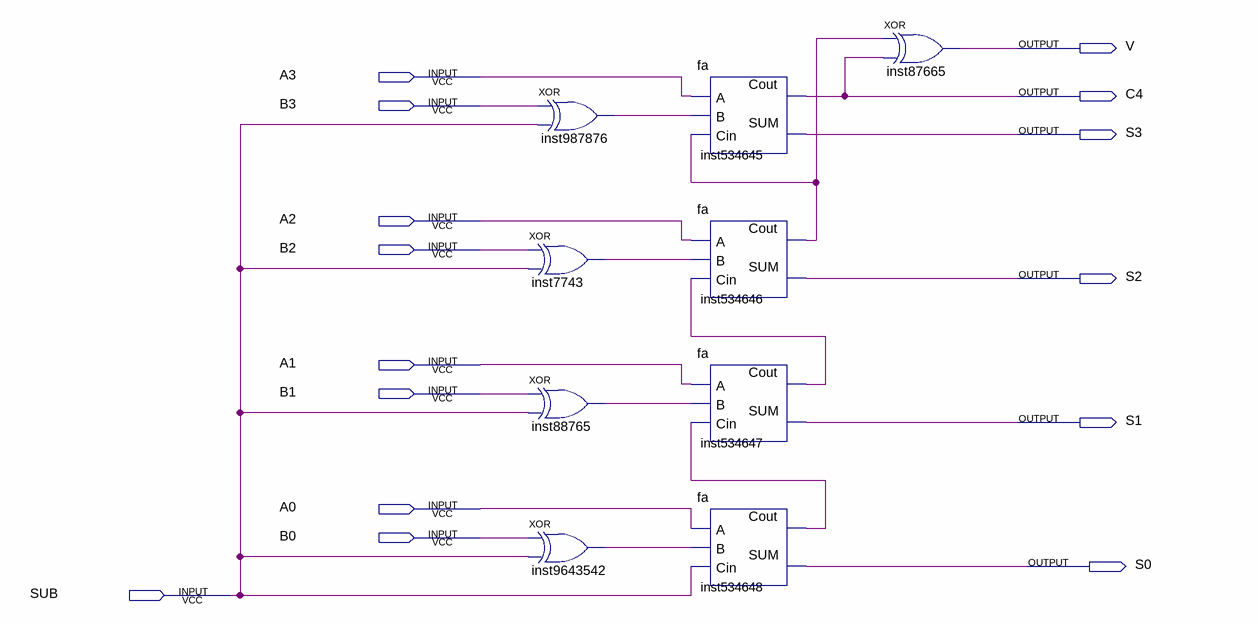
[diagram p0: schematic sheet]
// Quartus schematic rca4bits.bdf as structural Verilog: 9 symbols, 15 pins
module rca4bits (
  input  A3,
  input  B3,
  input  A2,
  input  B2,
  input  A1,
  input  B1,
  input  A0,
  input  B0,
  input  SUB,
  output V,
  output C4,
  output S3,
  output S2,
  output S1,
  output S0
);

  wire inst7743_out, inst88765_out, inst534646_cout, inst534647_cout, inst534648_cout, inst987876_out,
       inst9643542_out;

  xor inst987876 (inst987876_out, B3, SUB);
  xor inst7743 (inst7743_out, B2, SUB);
  xor inst88765 (inst88765_out, B1, SUB);
  xor inst9643542 (inst9643542_out, B0, SUB);
  fa inst534645 (.A(A3), .B(inst987876_out), .Cin(inst534646_cout), .SUM(S3), .Cout(C4));
  fa inst534646 (.A(A2), .B(inst7743_out), .Cin(inst534647_cout), .SUM(S2), .Cout(inst534646_cout));
  fa inst534647 (.A(A1), .B(inst88765_out), .Cin(inst534648_cout), .SUM(S1), .Cout(inst534647_cout));
  fa inst534648 (.A(A0), .B(inst9643542_out), .Cin(SUB), .SUM(S0), .Cout(inst534648_cout));
  xor inst87665 (V, inst534646_cout, C4);
endmodule
